# EAGLE design flatsat (EAGLE 7.4.0)
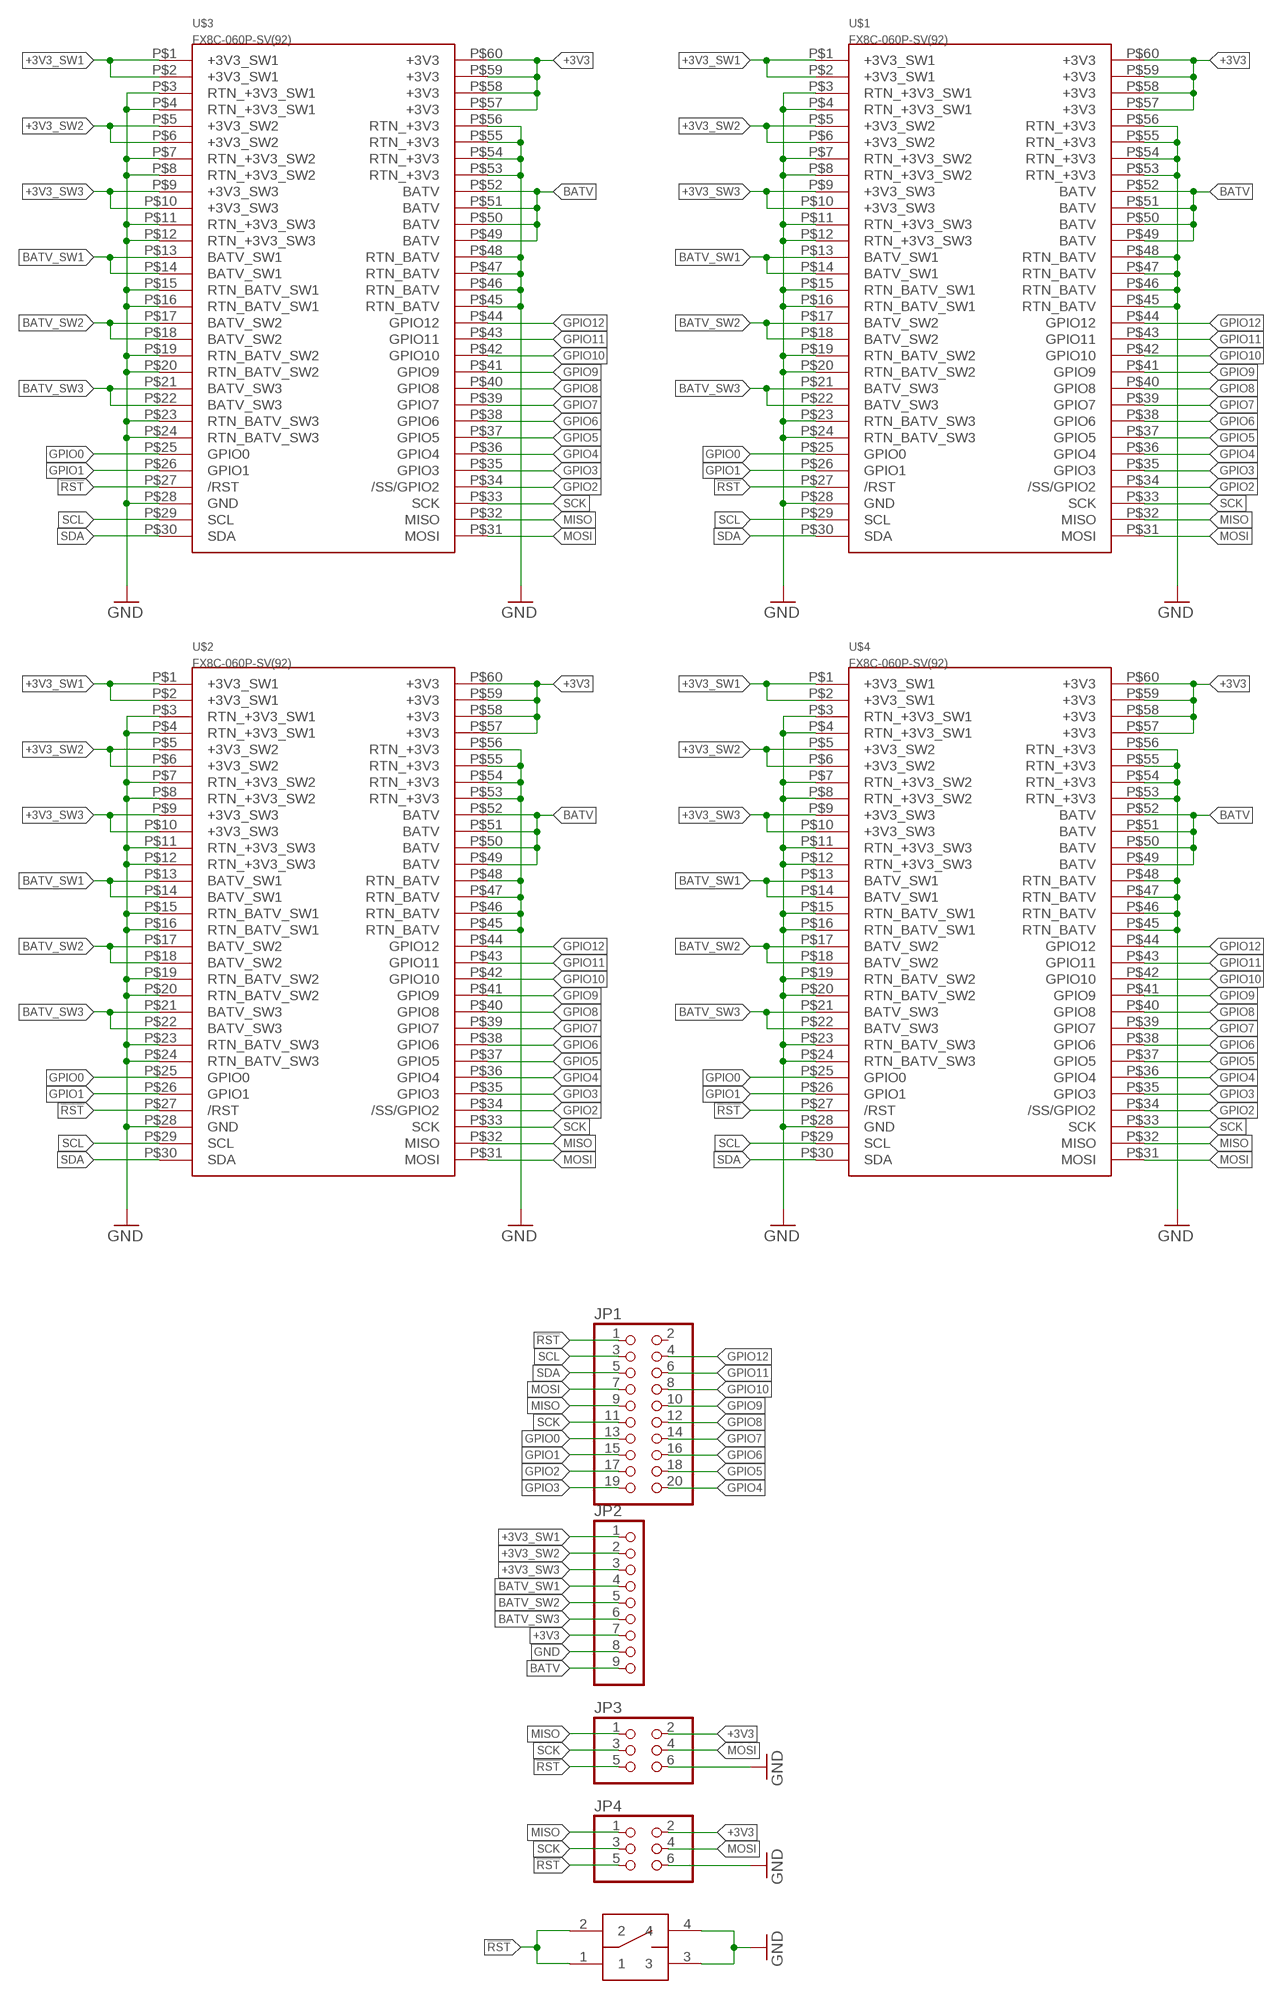
[diagram p0: schematic, sheet 1]

## Parts
JP1  PINHD-2X10  [2X10]
JP2  PINHD-1X9  [1X09]
JP3  PINHD-2X3  [2X03]
JP4  PINHD-2X3  [2X03]
U$1  FX8C-060P-SV(92)  [FX8C-060P-SV(92)]
U$2  FX8C-060P-SV(92)  [FX8C-060P-SV(92)]
U$3  FX8C-060P-SV(92)  [FX8C-060P-SV(92)]
U$4  FX8C-060P-SV(92)  [FX8C-060P-SV(92)]
U$5  SWITCH-TL3301  [SWITCH-TL3301]

## Nets
!RST: JP1.1 JP3.5 JP4.5 U$1.P$27(/RST) U$2.P$27(/RST) U$3.P$27(/RST) U$4.P$27(/RST) U$5.1 U$5.2
+3V3: JP2.7 JP3.2 JP4.2 U$1.P$57(+3V3) U$1.P$58(+3V3) U$1.P$59(+3V3) U$1.P$60(+3V3) U$2.P$57(+3V3) U$2.P$58(+3V3) U$2.P$59(+3V3) U$2.P$60(+3V3) U$3.P$57(+3V3) U$3.P$58(+3V3) U$3.P$59(+3V3) U$3.P$60(+3V3) U$4.P$57(+3V3) U$4.P$58(+3V3) U$4.P$59(+3V3) U$4.P$60(+3V3)
+3V3_SW1: JP2.1 U$1.P$1(+3V3_SW1) U$1.P$2(+3V3_SW1) U$2.P$1(+3V3_SW1) U$2.P$2(+3V3_SW1) U$3.P$1(+3V3_SW1) U$3.P$2(+3V3_SW1) U$4.P$1(+3V3_SW1) U$4.P$2(+3V3_SW1)
+3V3_SW2: JP2.2 U$1.P$5(+3V3_SW2) U$1.P$6(+3V3_SW2) U$2.P$5(+3V3_SW2) U$2.P$6(+3V3_SW2) U$3.P$5(+3V3_SW2) U$3.P$6(+3V3_SW2) U$4.P$5(+3V3_SW2) U$4.P$6(+3V3_SW2)
+3V3_SW3: JP2.3 U$1.P$9(+3V3_SW3) U$1.P$10(+3V3_SW3) U$2.P$9(+3V3_SW3) U$2.P$10(+3V3_SW3) U$3.P$9(+3V3_SW3) U$3.P$10(+3V3_SW3) U$4.P$9(+3V3_SW3) U$4.P$10(+3V3_SW3)
BATV: JP2.9 U$1.P$49(BATV) U$1.P$50(BATV) U$1.P$51(BATV) U$1.P$52(BATV) U$2.P$49(BATV) U$2.P$50(BATV) U$2.P$51(BATV) U$2.P$52(BATV) U$3.P$49(BATV) U$3.P$50(BATV) U$3.P$51(BATV) U$3.P$52(BATV) U$4.P$49(BATV) U$4.P$50(BATV) U$4.P$51(BATV) U$4.P$52(BATV)
BATV_SW1: JP2.4 U$1.P$13(BATV_SW1) U$1.P$14(BATV_SW1) U$2.P$13(BATV_SW1) U$2.P$14(BATV_SW1) U$3.P$13(BATV_SW1) U$3.P$14(BATV_SW1) U$4.P$13(BATV_SW1) U$4.P$14(BATV_SW1)
BATV_SW2: JP2.5 U$1.P$17(BATV_SW2) U$1.P$18(BATV_SW2) U$2.P$17(BATV_SW2) U$2.P$18(BATV_SW2) U$3.P$17(BATV_SW2) U$3.P$18(BATV_SW2) U$4.P$17(BATV_SW2) U$4.P$18(BATV_SW2)
BATV_SW3: JP2.6 U$1.P$21(BATV_SW3) U$1.P$22(BATV_SW3) U$2.P$21(BATV_SW3) U$2.P$22(BATV_SW3) U$3.P$21(BATV_SW3) U$3.P$22(BATV_SW3) U$4.P$21(BATV_SW3) U$4.P$22(BATV_SW3)
GND: JP2.8 JP3.6 JP4.6 U$1.P$3(RTN_+3V3_SW1) U$1.P$4(RTN_+3V3_SW1) U$1.P$7(RTN_+3V3_SW2) U$1.P$8(RTN_+3V3_SW2) U$1.P$11(RTN_+3V3_SW3) U$1.P$12(RTN_+3V3_SW3) U$1.P$15(RTN_BATV_SW1) U$1.P$16(RTN_BATV_SW1) U$1.P$19(RTN_BATV_SW2) U$1.P$20(RTN_BATV_SW2) U$1.P$23(RTN_BATV_SW3) U$1.P$24(RTN_BATV_SW3) U$1.P$28(GND) U$1.P$45(RTN_BATV) U$1.P$46(RTN_BATV) U$1.P$47(RTN_BATV) U$1.P$48(RTN_BATV) U$1.P$53(RTN_+3V3) U$1.P$54(RTN_+3V3) U$1.P$55(RTN_+3V3) U$1.P$56(RTN_+3V3) U$2.P$3(RTN_+3V3_SW1) U$2.P$4(RTN_+3V3_SW1) U$2.P$7(RTN_+3V3_SW2) U$2.P$8(RTN_+3V3_SW2) U$2.P$11(RTN_+3V3_SW3) U$2.P$12(RTN_+3V3_SW3) U$2.P$15(RTN_BATV_SW1) U$2.P$16(RTN_BATV_SW1) U$2.P$19(RTN_BATV_SW2) U$2.P$20(RTN_BATV_SW2) U$2.P$23(RTN_BATV_SW3) U$2.P$24(RTN_BATV_SW3) U$2.P$28(GND) U$2.P$45(RTN_BATV) U$2.P$46(RTN_BATV) U$2.P$47(RTN_BATV) U$2.P$48(RTN_BATV) U$2.P$53(RTN_+3V3) U$2.P$54(RTN_+3V3) U$2.P$55(RTN_+3V3) U$2.P$56(RTN_+3V3) U$3.P$3(RTN_+3V3_SW1) U$3.P$4(RTN_+3V3_SW1) U$3.P$7(RTN_+3V3_SW2) U$3.P$8(RTN_+3V3_SW2) U$3.P$11(RTN_+3V3_SW3) U$3.P$12(RTN_+3V3_SW3) U$3.P$15(RTN_BATV_SW1) U$3.P$16(RTN_BATV_SW1) U$3.P$19(RTN_BATV_SW2) U$3.P$20(RTN_BATV_SW2) U$3.P$23(RTN_BATV_SW3) U$3.P$24(RTN_BATV_SW3) U$3.P$28(GND) U$3.P$45(RTN_BATV) U$3.P$46(RTN_BATV) U$3.P$47(RTN_BATV) U$3.P$48(RTN_BATV) U$3.P$53(RTN_+3V3) U$3.P$54(RTN_+3V3) U$3.P$55(RTN_+3V3) U$3.P$56(RTN_+3V3) U$4.P$3(RTN_+3V3_SW1) U$4.P$4(RTN_+3V3_SW1) U$4.P$7(RTN_+3V3_SW2) U$4.P$8(RTN_+3V3_SW2) U$4.P$11(RTN_+3V3_SW3) U$4.P$12(RTN_+3V3_SW3) U$4.P$15(RTN_BATV_SW1) U$4.P$16(RTN_BATV_SW1) U$4.P$19(RTN_BATV_SW2) U$4.P$20(RTN_BATV_SW2) U$4.P$23(RTN_BATV_SW3) U$4.P$24(RTN_BATV_SW3) U$4.P$28(GND) U$4.P$45(RTN_BATV) U$4.P$46(RTN_BATV) U$4.P$47(RTN_BATV) U$4.P$48(RTN_BATV) U$4.P$53(RTN_+3V3) U$4.P$54(RTN_+3V3) U$4.P$55(RTN_+3V3) U$4.P$56(RTN_+3V3) U$5.3 U$5.4
GPIO0: JP1.13 U$1.P$25(GPIO0) U$2.P$25(GPIO0) U$3.P$25(GPIO0) U$4.P$25(GPIO0)
GPIO1: JP1.15 U$1.P$26(GPIO1) U$2.P$26(GPIO1) U$3.P$26(GPIO1) U$4.P$26(GPIO1)
GPIO2: JP1.17 U$1.P$34(/SS/GPIO2) U$2.P$34(/SS/GPIO2) U$3.P$34(/SS/GPIO2) U$4.P$34(/SS/GPIO2)
GPIO3: JP1.19 U$1.P$35(GPIO3) U$2.P$35(GPIO3) U$3.P$35(GPIO3) U$4.P$35(GPIO3)
GPIO4: JP1.20 U$1.P$36(GPIO4) U$2.P$36(GPIO4) U$3.P$36(GPIO4) U$4.P$36(GPIO4)
GPIO5: JP1.18 U$1.P$37(GPIO5) U$2.P$37(GPIO5) U$3.P$37(GPIO5) U$4.P$37(GPIO5)
GPIO6: JP1.16 U$1.P$38(GPIO6) U$2.P$38(GPIO6) U$3.P$38(GPIO6) U$4.P$38(GPIO6)
GPIO7: JP1.14 U$1.P$39(GPIO7) U$2.P$39(GPIO7) U$3.P$39(GPIO7) U$4.P$39(GPIO7)
GPIO8: JP1.12 U$1.P$40(GPIO8) U$2.P$40(GPIO8) U$3.P$40(GPIO8) U$4.P$40(GPIO8)
GPIO9: JP1.10 U$1.P$41(GPIO9) U$2.P$41(GPIO9) U$3.P$41(GPIO9) U$4.P$41(GPIO9)
GPIO10: JP1.8 U$1.P$42(GPIO10) U$2.P$42(GPIO10) U$3.P$42(GPIO10) U$4.P$42(GPIO10)
GPIO11: JP1.6 U$1.P$43(GPIO11) U$2.P$43(GPIO11) U$3.P$43(GPIO11) U$4.P$43(GPIO11)
GPIO12: JP1.4 U$1.P$44(GPIO12) U$2.P$44(GPIO12) U$3.P$44(GPIO12) U$4.P$44(GPIO12)
MISO: JP1.9 JP3.1 JP4.1 U$1.P$32(MISO) U$2.P$32(MISO) U$3.P$32(MISO) U$4.P$32(MISO)
MOSI: JP1.7 JP3.4 JP4.4 U$1.P$31(MOSI) U$2.P$31(MOSI) U$3.P$31(MOSI) U$4.P$31(MOSI)
SCK: JP1.11 JP3.3 JP4.3 U$1.P$33(SCK) U$2.P$33(SCK) U$3.P$33(SCK) U$4.P$33(SCK)
SCL: JP1.3 U$1.P$29(SCL) U$2.P$29(SCL) U$3.P$29(SCL) U$4.P$29(SCL)
SDA: JP1.5 U$1.P$30(SDA) U$2.P$30(SDA) U$3.P$30(SDA) U$4.P$30(SDA)
Unconnected: JP1.2

## Library data of the parts
JP1 = pinhead:PINHD-2X10: PIN HEADER
JP2 = pinhead:PINHD-1X9: PIN HEADER
JP3 JP4 = pinhead:PINHD-2X3: PIN HEADER
U$1-U$4 = PQ60:FX8C-060P-SV(92)
U$5 = switch-tl3301:SWITCH-TL3301

## Net classes
0 default: clearance 0.205 mm

## Board
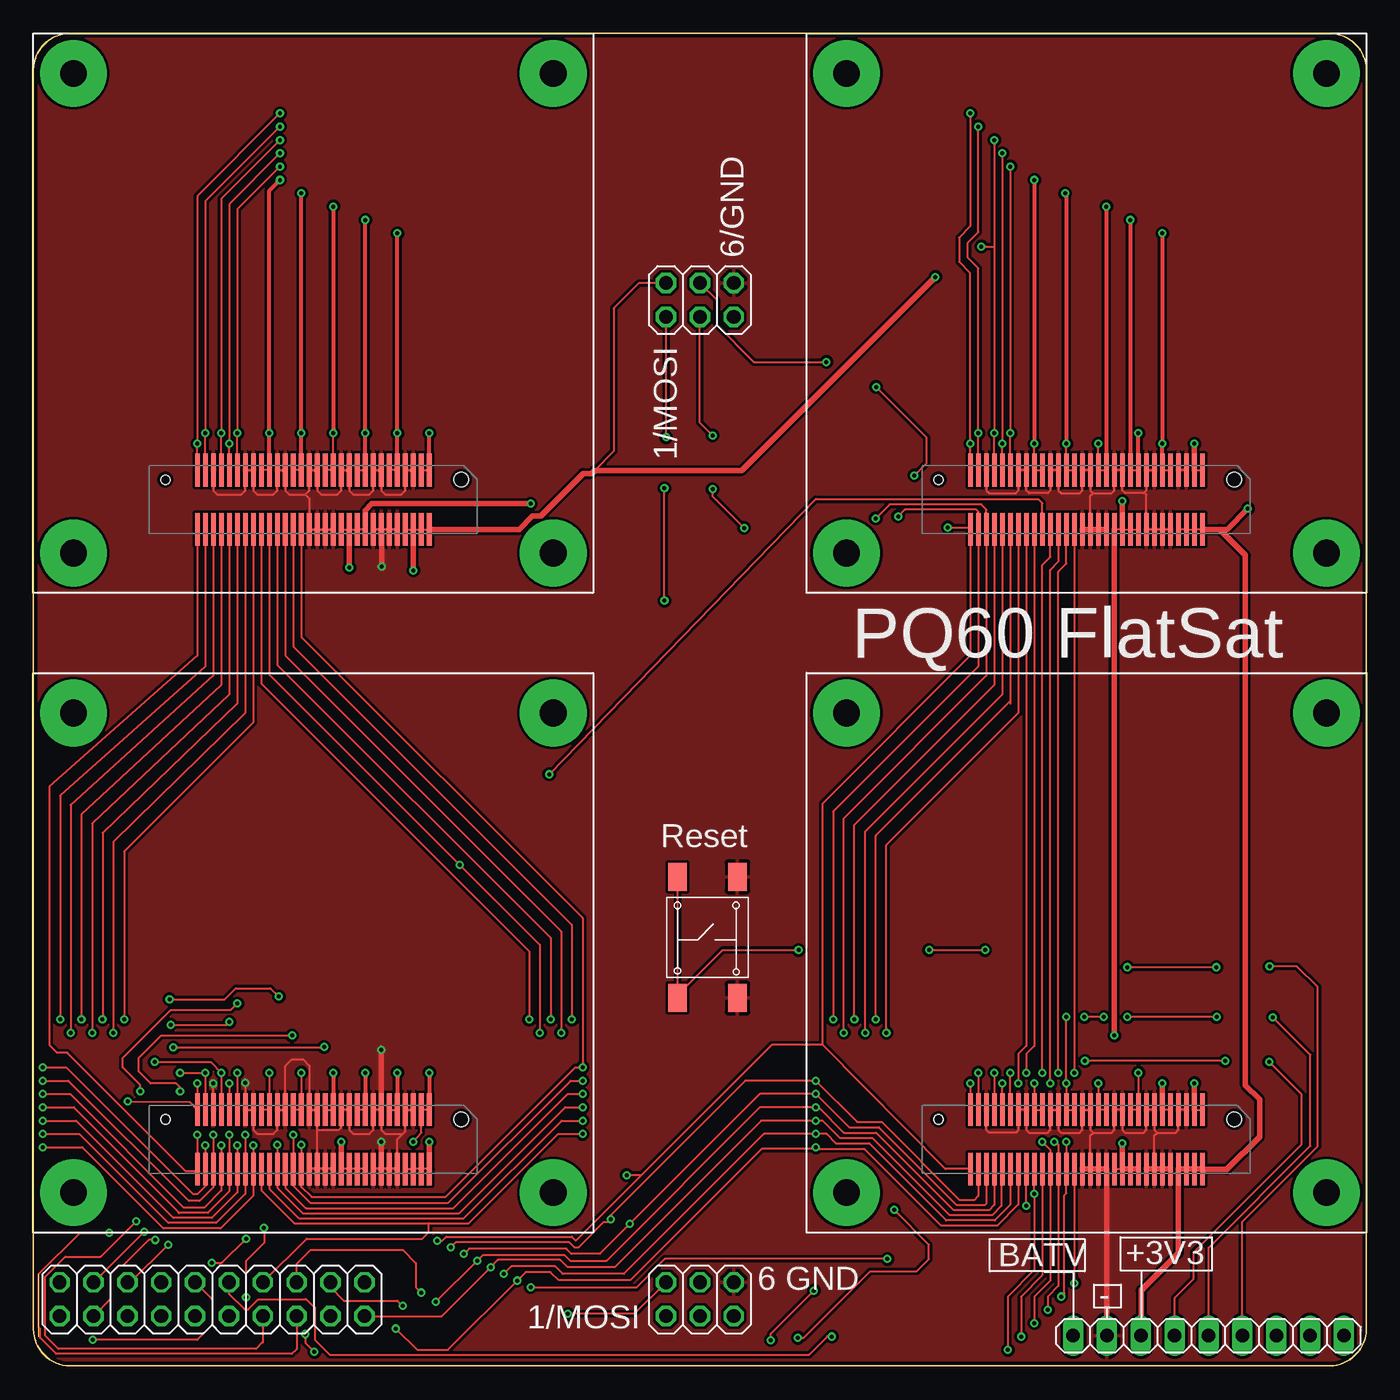
[diagram p1: board, top side]
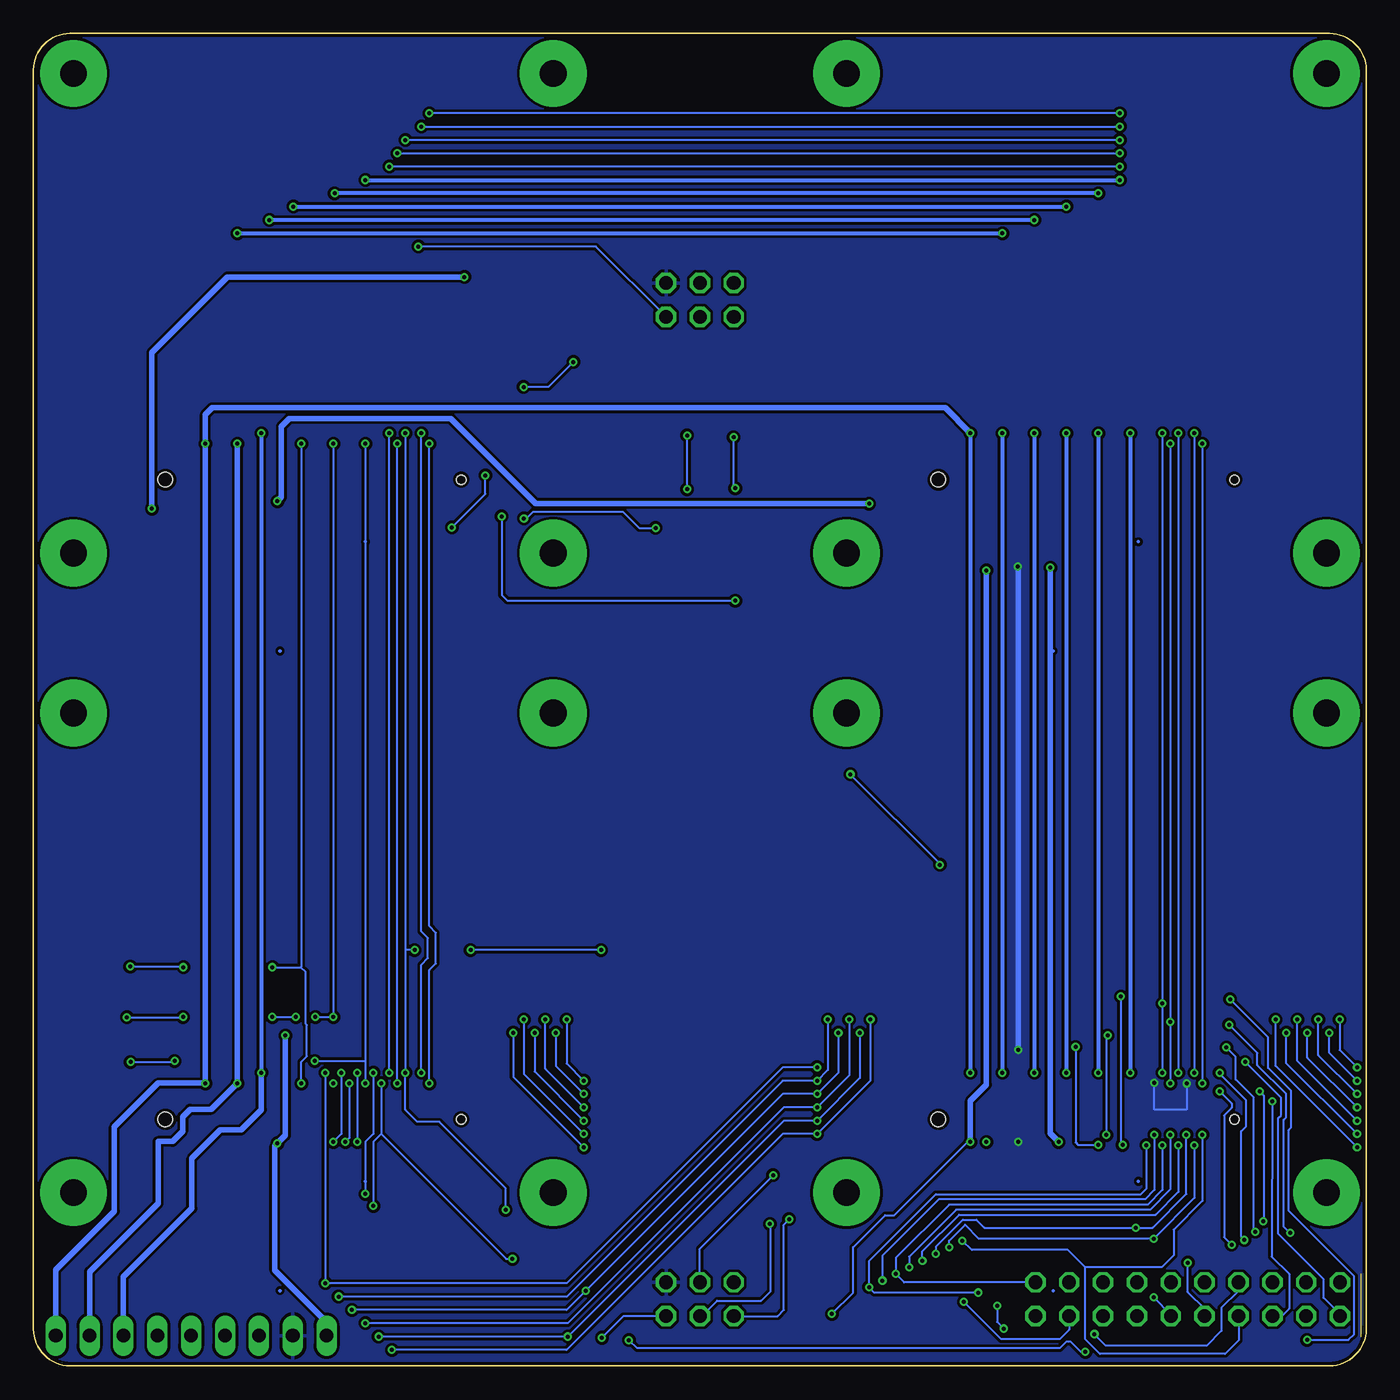
[diagram p2: board, bottom side, seen from below]

Size 100.01 x 100.01 mm. Coordinates in mm from the lower left corner, seen from the top.
Outline: 3.01,100.01 97.01,100.01 arc-98 100.01,97.01 100.01,3.01 arc-98 97.01,0.01 3.01,0.01 arc-98 0.01,3.01 0.01,97.01 arc-98 3.01,100.01
Copper layers (1*16): Top 0.035mm / dielectric 1.5mm / Bottom 0.035mm
Design rules "ITeadstudio *": minimum track width 6mil, minimum drill 0.3mm, track to track 6mil, track to pad 6mil, pad to pad 6mil, via to via 6mil, smd to smd 0mil, copper to edge 10mil, drill to drill 10mil, minimum pad ring 10mil, minimum via ring 6mil, stop-mask expansion 2mil, vias tented up to drill 100mil, thermal gap 10mil

### Footprints (pad centres in the part's own frame; a part is rotated, then mirrored left to right if it is on the bottom)
2X10 = drill 1.016 octagon: 1 -11.43,-1.27; 2 -11.43,1.27; 3 -8.89,-1.27; 4 -8.89,1.27; 5 -6.35,-1.27; 6 -6.35,1.27; 7 -3.81,-1.27; 8 -3.81,1.27; 9 -1.27,-1.27; 10 -1.27,1.27; 11 1.27,-1.27; 12 1.27,1.27; 13 3.81,-1.27; 14 3.81,1.27; 15 6.35,-1.27; 16 6.35,1.27; 17 8.89,-1.27; 18 8.89,1.27; 19 11.43,-1.27; 20 11.43,1.27
1X09 = drill 1.016 long: 1 -10.16,0; 2 -7.62,0; 3 -5.08,0; 4 -2.54,0; 5 0,0; 6 2.54,0; 7 5.08,0; 8 7.62,0; 9 10.16,0
2X03 = drill 1.016 octagon: 1 -2.54,-1.27; 2 -2.54,1.27; 3 0,-1.27; 4 0,1.27; 5 2.54,-1.27; 6 2.54,1.27
FX8C-060P-SV(92) = smd 0.35 x 2.45: P$1 -8.7,-2.225; P$2 -8.1,-2.225; P$3 -7.5,-2.225; P$4 -6.9,-2.225; P$5 -6.3,-2.225; P$6 -5.7,-2.225; P$7 -5.1,-2.225; P$8 -4.5,-2.225; P$9 -3.9,-2.225; P$10 -3.3,-2.225; P$11 -2.7,-2.225; P$12 -2.1,-2.225; P$13 -1.5,-2.225; P$14 -0.9,-2.225; P$15 -0.3,-2.225; P$16 0.3,-2.225; P$17 0.9,-2.225; P$18 1.5,-2.225; P$19 2.1,-2.225; P$20 2.7,-2.225; P$21 3.3,-2.225; P$22 3.9,-2.225; P$23 4.5,-2.225; P$24 5.1,-2.225; P$25 5.7,-2.225; P$26 6.3,-2.225; P$27 6.9,-2.225; P$28 7.5,-2.225; P$29 8.1,-2.225; P$30 8.7,-2.225; P$31 8.7,2.225; P$32 8.1,2.225; P$33 7.5,2.225; P$34 6.9,2.225; P$35 6.3,2.225; P$36 5.7,2.225; P$37 5.1,2.225; P$38 4.5,2.225; P$39 3.9,2.225; P$40 3.3,2.225; P$41 2.7,2.225; P$42 2.1,2.225; P$43 1.5,2.225; P$44 0.9,2.225; P$45 0.3,2.225; P$46 -0.3,2.225; P$47 -0.9,2.225; P$48 -1.5,2.225; P$49 -2.1,2.225; P$50 -2.7,2.225; P$51 -3.3,2.225; P$52 -3.9,2.225; P$53 -4.5,2.225; P$54 -5.1,2.225; P$55 -5.7,2.225; P$56 -6.3,2.225; P$57 -6.9,2.225; P$58 -7.5,2.225; P$59 -8.1,2.225; P$60 -8.7,2.225 | hole 1.1: -11.1,-1.5 | hole 0.7: 11.1,-1.5
SWITCH-TL3301 = smd 1.4 x 2.1: 1 -2.3,-4.55; 2 -2.3,4.55; 3 2.2,-4.55; 4 2.2,4.55

### Placement (x,y rotation side)
JP1  13.41,5.01 0 top
JP2  88.17,2.27 180 top
JP3  50.01,5.01 0 top
JP4  50.01,80.01 0 top
U$1  21.01,65.01 180 top
U$2  79.01,65.01 180 top
U$3  79.01,17.01 180 top
U$4  21.01,17.01 180 top
U$5  50.63,32.16 0 top

### Tracks (layer width: path | path; a pad name or v marks a point on that pad's centre or on a via)
!RST  (via drill 0.3)
  Top 0.152: U$1.P$27 v14.11,70.01 14.11,87.61 v18.51,92.01 | U$4.P$27 v14.11,22.01 13.31,22.81 v9.11,22.81 | v72.11,92.01 72.11,84 | 72.11,84 v72.11,70.01 U$2.P$27 | v72.11,22.01 U$3.P$27 | U$5.2 U$5.1 48.33,27.83 51.71,31.21 v57.41,31.21 | v67.21,31.21 v71.41,31.21 | v71.13,84.01 71.51,84 72.11,84 | v57.36,2.11 57.79,2.11 62.77,7.09 66.28,7.09 67.19,8.01 67.19,9.1 v64.57,11.72
  Bottom 0.152: v14.11,70.01 v14.11,22.01 | v18.51,92.01 v72.11,92.01 | v72.11,70.01 72.11,31.21 | 72.11,31.21 v72.11,22.01 U$3.P$27 71.19,18.32 69.55,18.32 64.57,13.34 v64.57,11.72 | JP1.1 1.98,3.88 3.21,5.11 3.21,6.51 6.61,9.91 6.61,18.61 6.41,18.81 6.41,20.11 v9.11,22.81 | v57.41,31.21 v67.21,31.21 | v71.41,31.21 72.11,31.21 | JP4.5 57.82,84.01 v71.13,84.01 | JP3.5 55.74,3.74 v57.36,2.11
+3V3  (via drill 0.3)
  Top 0.152: U$1.P$57 U$1.P$58 U$1.P$59 U$1.P$60 | U$4.P$60 U$4.P$59 U$4.P$58 U$4.P$57 | U$2.P$60 U$2.P$59 U$2.P$58 U$2.P$57 | JP3.2 45.1,3.91 v40.11,3.91 | JP4.2 45.44,81.28 43.54,79.38 43.54,68.64 42.11,67.21
  Top 0.4: U$4.P$60 v29.71,16.81 | v28.51,59.71 U$1.P$58 | U$1.P$60 36.44,62.78 37.45,63.79 38.06,63.79 41.26,66.99 41.89,66.99 42.11,67.21 53.16,67.21 v67.67,81.72 67.66,81.71 | JP2.7 83.12,2.29 83.12,5.67 85.91,8.46 U$3.P$57 U$3.P$58 U$3.P$59 U$3.P$60 87.75,14.74 89.54,14.74 92.01,17.2 92.01,20.01 90.94,21.07 90.94,60.84 89,62.78 U$2.P$60 89.55,62.78 v91.12,64.34
  Bottom 0.152: v40.11,3.91 38.51,5.51 38.51,8.91 36.11,11.31 35.41,11.31 29.91,16.81 v29.71,16.81
  Bottom 0.4: v29.71,16.81 29.71,19.91 28.51,21.11 v28.51,59.71 | v67.67,81.72 85.45,81.72 91.12,76.05 v91.12,64.34
+3V3_SW1  (via drill 0.3)
  Top 0.152: U$1.P$2 U$1.P$1 | U$4.P$1 U$4.P$2 29.11,17.51 v28.51,16.81 | U$2.P$2 U$2.P$1 | U$3.P$2 U$3.P$1
  Top 0.305: U$1.P$1 v29.71,70.01 | v29.71,22.01 U$4.P$1
  Top 0.4: v87.11,21.21 U$3.P$2 | U$2.P$2 v87.11,69.21
  Bottom 0.305: v29.71,70.01 v29.71,22.01
  Bottom 0.4: v29.71,70.01 31.61,71.91 86.61,71.91 87.11,71.41 v87.11,69.21 v87.11,21.21 87.14,21.24 90.63,21.24 93.94,17.94 93.94,11.61 98.33,7.22 JP2.1
+3V3_SW2  (via drill 0.3)
  Top 0.152: U$1.P$5 U$1.P$6 | U$4.P$6 U$4.P$5 | U$2.P$5 U$2.P$6 84.71,66.51 | U$3.P$5 U$3.P$6
  Top 0.305: U$1.P$5 v27.31,70.01 v27.31,85.01 | v27.31,22.01 U$4.P$5 | v84.71,85.01 v84.71,69.21 U$2.P$6
  Top 0.4: v84.71,21.21 U$3.P$6
  Bottom 0.305: v27.31,70.01 v27.31,22.01 | v84.71,85.01 v27.31,85.01
  Bottom 0.4: v84.71,69.21 v84.71,21.21 86.65,19.26 88.25,19.26 88.81,18.7 88.81,17.61 89.57,16.85 90.66,16.85 90.66,12.2 95.79,7.07 JP2.2
+3V3_SW3  (via drill 0.3)
  Top 0.152: U$1.P$10 U$1.P$9 | U$4.P$9 U$4.P$10 | U$2.P$10 U$2.P$9 | U$3.P$10 U$3.P$9 v82.91,22.01
  Top 0.305: U$1.P$9 v24.91,70.01 v24.91,86.01 | v24.91,22.01 U$4.P$9 | v82.31,86.01 U$2.P$10 | U$2.P$9 v82.91,70.01
  Bottom 0.305: v24.91,70.01 v24.91,22.01 | v24.91,86.01 v82.31,86.01 | v82.91,70.01 v82.91,22.01
  Bottom 0.4: JP2.3 93.25,6.69 88.12,11.82 88.12,15.58 85.99,17.71 84.43,17.71 U$3.P$9 v82.91,22.01
BATV  (via drill 0.3)
  Top 0.152: U$1.P$49 U$1.P$50 U$1.P$51 U$1.P$52 | U$4.P$49 U$4.P$50 U$4.P$52 U$4.P$51 | U$2.P$52 U$2.P$51 U$2.P$50 U$2.P$49 | U$3.P$49 U$3.P$50
  Top 0.4: v23.1,16.81 23.1,14.79 U$4.P$49 | v23.71,59.91 U$1.P$50 | U$3.P$52 U$3.P$51 U$3.P$50 v81.71,16.71 | U$1.P$52 24.91,64.21 25.41,64.71 v37.31,64.71 | v81.71,64.91 U$2.P$50 | v81.11,24.8 U$2.P$49
  Bottom 0.4: v23.1,16.81 23.71,17.46 v23.71,59.91 | v81.11,24.8 81.11,17.3 v81.71,16.71 81.9,16.52 81.9,7.17 78.01,3.28 JP2.9 | v37.31,64.71 62.31,64.71 68.71,71.11 80.81,71.11 81.41,70.51 81.41,65.21 v81.71,64.91
BATV_SW1  (via drill 0.3)
  Top 0.152: U$1.P$14 U$1.P$13 v22.51,70.01 | U$4.P$14 U$4.P$13 | U$2.P$13 U$2.P$14 v79.91,69.21 | U$3.P$13 U$3.P$14 v79.91,21.21 | JP2.4 90.71,10.83 96.35,16.47 96.35,28.43 94.8,29.98 v92.74,29.98 | v88.75,29.93 v82.07,29.93
  Top 0.305: v22.51,22.01 U$4.P$13 | v80.51,87.01 U$2.P$13 | v22.51,87.01 v22.51,70.01
  Bottom 0.152: v79.91,69.21 79.91,29.98 79.96,29.93 | v92.74,29.98 88.8,29.98 v88.75,29.93 | v82.07,29.93 79.96,29.93 | v79.91,21.21 79.91,22.82 79.48,23.25 79.48,25.58 79.58,25.69 79.58,29.56 79.96,29.93
  Bottom 0.305: v22.51,70.01 v22.51,22.01 | v80.51,87.01 v22.51,87.01
BATV_SW2  (via drill 0.3)
  Top 0.152: U$1.P$17 U$1.P$18 | v20.11,22.01 U$4.P$17 U$4.P$18 | U$2.P$17 U$2.P$18 v77.51,69.21 | U$3.P$17 U$3.P$18 v77.51,21.21 v77.51,26.19 | JP2.5 88.17,8.87 95.82,16.52 95.82,23.35 v93,26.17 | v88.78,26.19 v82.07,26.19 | v80.32,26.19 v78.85,26.19
  Top 0.305: U$1.P$17 v20.11,70.01 v20.11,88.01 | v77.41,88.01 77.51,88.01 v77.51,69.21
  Bottom 0.152: v77.51,69.21 v77.51,26.19 v78.85,26.19 | v93,26.17 88.8,26.17 v88.78,26.19 | v82.07,26.19 v80.32,26.19
  Bottom 0.305: v20.11,70.01 v20.11,22.01 | v20.11,88.01 v77.41,88.01
BATV_SW3  (via drill 0.3)
  Top 0.152: U$1.P$21 U$1.P$22 | v17.71,22.01 U$4.P$21 U$4.P$22 | U$2.P$21 U$2.P$22 v75.11,69.21 | v75.11,21.21 U$3.P$22 U$3.P$21 | JP2.6 85.63,5.11 87.05,6.53 87.05,8.52 95.15,16.62 95.15,20.38 v92.72,22.82 | v89.41,22.89 v78.9,22.89
  Top 0.305: U$1.P$21 v17.71,70.01 17.71,88.21 v18.51,89.01 | v75.11,89.01 v75.11,69.21
  Bottom 0.152: v75.11,69.21 75.11,22.92 | 75.11,22.92 v75.11,21.21 | v92.72,22.82 89.49,22.82 v89.41,22.89 | v78.9,22.89 75.13,22.89 75.11,22.92
  Bottom 0.305: v17.71,70.01 v17.71,22.01 | v75.11,89.01 v18.51,89.01
CHASSIS_GND  (via drill 2 pad 5)
  other vias: 39.01,49.01
GND  (via drill 0.3)
  Top 0.152: U$1.P$28 13.51,65.71 13.81,65.41 15.61,65.41 15.91,65.71 U$1.P$24 U$1.P$23 16.51,65.71 16.81,65.41 18.01,65.41 18.31,65.71 U$1.P$20 U$1.P$19 18.91,65.71 19.21,65.41 20.41,65.41 | U$1.P$3 U$1.P$4 27.91,65.71 27.61,65.41 26.41,65.41 26.11,65.71 U$1.P$7 U$1.P$8 25.51,65.71 25.21,65.41 24.01,65.41 23.71,65.71 U$1.P$11 U$1.P$12 23.11,65.71 22.81,65.41 21.61,65.41 21.31,65.71 U$1.P$15 U$1.P$16 20.71,65.71 20.41,65.41 | U$1.P$48 U$1.P$47 U$1.P$46 U$1.P$45 20.71,65.11 20.41,65.41 | U$1.P$53 U$1.P$54 U$1.P$55 U$1.P$56 26.73,62.78 26.71,62.81 | U$4.P$3 U$4.P$4 27.91,17.61 27.71,17.41 | U$4.P$53 U$4.P$54 U$4.P$55 U$4.P$56 27.31,17.01 27.71,17.41 | U$4.P$48 U$4.P$47 U$4.P$46 | U$4.P$46 U$4.P$45 | 27.71,17.41 26.41,17.41 26.11,17.71 U$4.P$7 U$4.P$8 25.51,17.71 25.21,17.41 24.01,17.41 23.71,17.71 U$4.P$11 U$4.P$12 23.07,19.19 23.07,17.86 22.89,17.68 21.33,17.68 21.31,17.66 | U$2.P$28 71.51,65.71 71.71,65.51 73.71,65.51 73.91,65.71 U$2.P$24 U$2.P$23 74.51,65.71 74.71,65.51 76.11,65.51 76.31,65.71 U$2.P$20 U$2.P$19 76.91,65.71 77.11,65.51 78.51,65.51 78.71,65.71 U$2.P$16 U$2.P$15 79.31,65.71 79.51,65.51 | U$2.P$3 U$2.P$4 | 79.51,65.51 80.91,65.51 81.11,65.71 U$2.P$12 U$2.P$11 81.71,65.71 81.91,65.51 83.31,65.51 83.36,65.56 | U$2.P$7 U$2.P$8 83.51,65.71 83.36,65.56 | U$2.P$46 79.31,65.31 79.51,65.51 | U$2.P$56 U$2.P$55 U$2.P$54 U$2.P$53 83.51,65.41 83.36,65.56 | U$3.P$3 U$3.P$4 85.91,17.71 85.71,17.51 84.31,17.51 | U$3.P$28 71.51,17.71 71.71,17.51 73.71,17.51 73.91,17.71 U$3.P$24 U$3.P$23 74.51,17.71 74.71,17.51 76.11,17.51 76.31,17.71 U$3.P$20 U$3.P$19 76.91,17.71 77.11,17.51 78.51,17.51 78.71,17.71 U$3.P$16 U$3.P$15 79.31,17.71 79.51,17.51
  Top 0.152: 79.51,17.51 80.91,17.51 81.11,17.71 U$3.P$12 U$3.P$11 81.71,17.71 81.91,17.51 83.31,17.51 83.51,17.71 U$3.P$8 U$3.P$7 84.11,17.71 84.31,17.51 | U$3.P$54 84.11,17.31 84.31,17.51 | U$3.P$46 79.31,17.31 79.51,17.51 | U$4.P$28 13.49,19.24 v13.49,21.19 | v15.91,21.24 | v15.91,21.24 U$4.P$24 U$4.P$23 16.51,17.71 16.81,17.41 18.01,17.41 18.31,17.71 U$4.P$20 U$4.P$19 18.91,22.51 19.39,22.99 20.25,22.99 20.71,22.54 U$4.P$16 U$4.P$15 21.31,17.66 | U$4.P$46 21.31,17.66
  Top 0.4: v26.11,23.71 U$4.P$7 | v26.11,16.81 U$4.P$54 | U$3.P$56 U$3.P$55 U$3.P$54 U$3.P$53 | U$3.P$45 U$3.P$46 U$3.P$47 U$3.P$48 80.55,14.74 JP2.8 | U$2.P$48 U$2.P$47 U$2.P$46 U$2.P$45 | v26.14,60 26.14,62.74 U$1.P$54
  Bottom 0.152: v13.49,21.19 13.49,19.23 U$4.P$28 U$4.P$24 | U$4.P$24 | U$4.P$24 v15.91,21.24
  Bottom 0.4: v26.11,23.71 26.11,59.96 v26.14,60
  pour Top: 48.19,100.06 0.03,100.06 0.03,0.01 100.01,0.01 100.01,100.01 48.47,100.01 48.47,100.13
  pour Bottom: 46.64,100.03 -0.04,100.03 -0.04,-0.02 100.01,-0.02 100.01,100.06 99.37,100.06
GPIO0  (via drill 0.3)
  Top 0.152: U$1.P$25 v15.31,70.01 15.31,86.81 v18.51,90.01 | v15.31,22.01 U$4.P$25 | v73.31,90.01 v73.31,70.01 U$2.P$25 | U$3.P$25 v73.31,22.01 | JP1.13 17.22,1.76 17.19,1.76 16.71,1.28 1.88,1.28 0.91,2.25 0.91,6.71 2.41,8.21 5.04,8.21 v7.73,10.85 | v8.01,20.61 8.01,21.11 6.71,22.41 6.71,23.11 10.31,26.71 14.81,26.71 v15.31,27.21
  Bottom 0.152: v15.31,70.01 v15.31,27.21 v15.31,22.01 | v18.51,90.01 v73.31,90.01 | v73.31,22.01 v73.31,70.01 | v8.01,20.61 7.71,20.31 7.71,10.87 v7.73,10.85
GPIO1  (via drill 0.3)  (1 unrouted)
  Top 0.152: U$1.P$26 v14.71,69.21 14.71,87.21 v18.51,91.01 | v14.71,21.21 U$4.P$26 | v72.71,91.01 v72.71,69.21 U$2.P$26 | U$3.P$26 v72.71,21.21 | JP1.15 19.76,1.26 19.41,0.91 1.71,0.91 0.51,2.11 0.51,2.81 0.41,2.91 0.41,6.91 3.51,10.01 4.31,10.01 v5.7,10.01 | v10.31,25.61 14.51,25.61 v14.71,25.81
  Bottom 0.152: v14.71,69.21 v14.71,25.81 v14.71,21.21 | v72.71,91.01 v18.51,91.01 | v72.71,21.21 v72.71,69.21 | v10.31,25.61 8.19,23.49 8.19,22.56 6.03,20.4 6.03,18.65 6.2,18.47 6.2,10.45 5.76,10.01 v5.7,10.01
GPIO2  (via drill 0.3)
  Top 0.152: U$1.P$34 14.11,51.11 3.61,41.41 v3.61,26.01 | U$4.P$34 14.1,13.16 12.81,11.87 11.29,11.87 2.76,20.41 v0.71,20.41 | U$2.P$34 72.11,51.11 61.61,40.61 v61.61,26.01 | 14.11,15.85 U$4.P$34 | v14.11,16.57 U$4.P$34 | v30.21,4.81 v33.31,7.91 33.74,8.34 39.83,8.34 40.27,7.91 43.01,7.91 54.51,19.41 v58.71,19.41 58.91,19.41 60.81,17.51 63.23,17.51 69.06,11.68 71.71,11.68 72.11,12.08 U$3.P$34
  Bottom 0.152: v0.71,20.41 3.61,23.31 v3.61,26.01 | v58.71,19.41 61.61,22.31 v61.61,26.01 | v33.31,7.91 33.31,8.61 30.56,11.35 15.81,11.35 14.11,13.05 v14.11,16.57 | JP1.17 22.3,2.72 23.01,2.01 27.41,2.01 v30.21,4.81
GPIO3  (via drill 0.3)
  Top 0.152: U$1.P$35 14.71,50.41 4.41,40.71 4.41,25.01 v4.43,25.01 | 10.95,11.49 13.09,11.49 14.71,13.11 14.71,14.77 U$4.P$35 14.71,15.32 | 10.95,11.49 10.87,11.49 | U$2.P$35 72.71,50.41 62.41,40.11 v62.41,25.01 | U$3.P$35 72.63,14.78 72.63,12 71.93,11.3 68.76,11.3 62.95,17.11 60.51,17.11 59.21,18.41 v58.71,18.41 54.61,18.41 43.61,7.41 40.08,7.41 39.53,7.96 34.86,7.96 v34.31,7.41 30.64,3.74 JP1.19 | 14.71,15.32 | v14.71,17.35 14.71,15.32 | v0.71,19.41 3.03,19.41 10.95,11.49
  Bottom 0.152: v0.71,19.41 4.43,23.13 v4.43,25.01 | v62.41,25.01 62.41,22.11 v58.71,18.41 | v14.71,17.35 14.71,13.26 16.23,11.73 30.78,11.73 34.31,8.21 v34.31,7.41
GPIO4  (via drill 0.3)
  Top 0.152: U$1.P$36 15.31,49.71 5.21,40.01 5.21,26.01 v5.19,26.01 | U$2.P$36 73.31,49.91 | 73.31,49.91 73.31,49.71 | v63.21,26.01 63.21,39.81 73.31,49.91 | v15.31,16.57 U$4.P$36 15.31,13.02 13.39,11.11 10.5,11.11 3.2,18.41 v0.71,18.41 | v35.31,6.91 35.87,7.47 39.15,7.47 39.72,6.91 44.31,6.91 54.81,17.41 v58.71,17.41 59.51,17.41 60.21,16.71 62.7,16.71 68.48,10.93 72.13,10.93 73.31,12.1 U$3.P$36
  Bottom 0.152: v0.71,18.41 5.19,22.89 v5.19,26.01 | v63.21,26.01 63.21,21.91 v58.71,17.41 | v15.31,16.57 15.31,13.21 16.41,12.11 31.31,12.11 35.31,8.11 v35.31,6.91 34.68,6.28 JP1.20
GPIO5  (via drill 0.3)
  Top 0.152: U$1.P$37 15.91,49.01 6.01,39.31 v6.01,25.01 v6,25.01 | U$4.P$37 | U$2.P$37 73.91,49.01 64.01,39.11 v64.01,25.01 | v58.71,16.41 58.71,16.31 | v15.91,17.35 U$4.P$37 | 58.71,16.31 54.66,16.31 44.79,6.43 39.4,6.43 38.79,7.04 36.94,7.04 v36.31,6.41 31.11,1.21 28.81,1.21 v27.21,2.81 | JP1.18 22.3,5.92 23.31,4.91 27.31,4.91 v27.71,4.51 | U$3.P$37 73.91,12.13 72.31,10.53 68.1,10.53 62.32,16.31 58.71,16.31 | U$4.P$37 15.91,12.91 13.72,10.73 10.13,10.73 3.45,17.41 v0.71,17.41
  Bottom 0.152: v0.71,17.41 6,22.7 v6,25.01 | v64.01,25.01 64.01,21.71 v58.71,16.41 | v15.91,17.35 15.91,13.21 16.6,12.51 32.08,12.51 36.31,8.28 v36.31,6.41 | v27.71,4.51 27.71,3.31 v27.21,2.81
GPIO6  (via drill 0.3)
  Top 0.152: U$1.P$38 16.51,48.31 6.81,38.61 v6.81,26.01 | U$2.P$38 74.51,24.01 73.91,23.41 v73.91,21.21 | v74.51,12.01 U$3.P$38 | v64.07,8.03 47.38,8.03 45.22,5.87 37.34,5.87 v37.31,5.91 | v16.51,16.57 U$4.P$38 16.52,14.77 16.52,12.78 14.05,10.32 9.76,10.32 3.68,16.41 v0.71,16.41 | JP1.16 19.76,7.66 20.81,8.71 27.71,8.71 28.71,7.71 28.71,5.91 v29.11,5.51
  Bottom 0.152: v0.71,16.41 6.81,22.51 v6.81,26.01 | v73.91,21.21 73.91,17.41 | 73.91,17.41 74.51,16.81 v74.51,12.01 | 73.91,17.41 64.53,8.03 v64.07,8.03 | v16.51,16.57 16.51,13.31 16.93,12.88 32.31,12.88 37.31,7.88 v37.31,5.91 36.91,5.51 v29.11,5.51
GPIO7  (via drill 0.3)
  Top 0.152: U$1.P$39 17.11,51.21 37.21,31.11 v37.21,26.01 | 29.67,10.71 19.58,10.71 17.11,13.18 U$4.P$39 | 29.67,10.71 32.68,10.71 39.38,17.41 v41.21,17.41 | v73.11,1.21 73.11,5.21 75.11,7.21 v75.11,12.91 U$3.P$39 | U$2.P$39 75.11,24.01 74.51,23.41 v74.51,22.01 | JP1.14 20.5,9.56 29.19,9.56 29.67,10.04 29.67,10.71
  Bottom 0.152: v37.21,26.01 37.21,21.41 v41.21,17.41 43.81,17.41 60.01,1.21 v73.11,1.21 | v74.51,22.01 74.51,17.41 75.11,16.81 v75.11,12.91
GPIO8  (via drill 0.3)
  Top 0.152: U$1.P$40 17.71,51.91 v32.01,37.61 38.01,31.61 v38.01,25.01 | U$3.P$40 75.71,6.81 74.11,5.21 v74.11,2.21 | v38.71,44.41 58.71,65.07 58.74,65.03 75.42,65.03 75.71,64.74 U$2.P$40 | U$4.P$40 17.71,13.28 19.91,11.08 32.31,11.08 39.63,18.41 v41.21,18.41 | v59.91,2.21 59.56,2.21 58.2,0.84 22.23,0.84 21.11,1.96 21.11,4.38 20.45,5.04 20.4,4.98 16.87,4.98 16.14,4.25 15.86,4.25 14.68,5.43 JP1.12
  Bottom 0.152: v38.01,25.01 38.01,21.61 v41.21,18.41 43.71,18.41 v59.91,2.21 v74.11,2.21 | v38.71,44.41 31.98,37.68 31.98,37.63 v32.01,37.61
GPIO9  (via drill 0.3)
  Top 0.152: U$1.P$41 18.31,52.61 38.81,32.11 v38.81,26.01 | v75.11,3.21 75.11,5.21 76.31,6.41 U$3.P$41 76.31,16.21 v75.71,16.81 | v41.21,19.41 39.9,19.41 31.96,11.46 20.2,11.46 18.31,13.36 U$4.P$41 18.29,14.79 v18.29,16.59 | JP1.10 13.42,5 13.42,3.08 12.3,1.96 v4.45,1.96 | v10.22,27.51 14.36,27.51 15.2,28.35 17.79,28.35 v18.42,27.72 | v75.71,22.01 75.71,60.11 76.31,60.71 U$2.P$41
  Bottom 0.152: v38.81,26.01 38.81,21.81 v41.21,19.41 43.71,19.41 59.91,3.21 v75.11,3.21 | v75.71,22.01 v75.71,16.81 | v4.45,1.96 1.35,1.96 0.92,2.39 0.92,6.74 5.82,11.64 5.82,17.71 5.65,17.89 5.65,20.63 7.37,22.36 7.37,24.67 v10.22,27.51 | v18.42,27.72 18.42,16.72 v18.29,16.59
GPIO10  (via drill 0.3)
  Top 0.152: U$1.P$42 18.91,53.31 39.61,32.61 v39.61,25.01 | v76.11,4.21 76.11,5.21 76.91,6.01 U$3.P$42 76.91,16.61 76.71,16.81 v76.61,16.81 | U$4.P$42 18.91,13.38 20.45,11.84 31.51,11.84 40.08,20.41 v41.21,20.41 | v55.33,1.94 55.33,2.42 v58.56,5.65 | v20.4,2.39 20.4,1.73 v21.09,1.05 | U$2.P$42 76.91,60.37 76.28,59.75 76.31,59.72 v76.31,21.21
  Bottom 0.152: v39.61,25.01 39.61,22.01 v41.21,20.41 43.81,20.41 v58.56,5.65 60.01,4.21 v76.11,4.21 | v76.31,21.21 76.31,17.11 v76.61,16.81 | JP1.8 9.6,5.66 10.88,4.38 10.88,2.62 11.97,1.53 19.54,1.53 v20.4,2.39 | v55.33,1.94 54.72,1.33 23.02,1.33 22.54,1.81 22.18,1.81 21.42,1.05 v21.09,1.05
GPIO11  (via drill 0.3)
  Top 0.152: U$1.P$43 19.51,54.01 40.41,33.11 v40.41,26.01 | v77.51,16.81 U$3.P$43 77.51,12.97 77.35,12.81 77.35,5.45 v77.11,5.21 | v11.01,20.61 11.01,20.91 10.71,21.21 8.81,21.21 7.91,22.11 7.91,23.11 9.61,24.81 19.47,24.81 v19.41,24.8 | JP1.6 7.29,6.28 v10.11,9.1 | v41.21,21.41 40.3,21.41 31.14,12.25 20.77,12.25 19.51,13.51 U$4.P$43 19.46,14.83 19.46,15.37 19.49,15.4 v19.51,17.33 | v76.91,22.01 76.91,59.61 77.5,60.2 U$2.P$43
  Bottom 0.152: v40.41,26.01 40.41,22.21 v41.21,21.41 43.81,21.41 60.01,5.21 v77.11,5.21 | v76.91,22.01 76.91,17.41 v77.51,16.81 | v11.01,20.61 10.11,19.71 10.11,19.37 10.67,18.8 10.67,9.66 v10.11,9.1 | v19.41,24.8 19.51,24.8 v19.51,17.33
GPIO12  (via drill 0.3)
  Top 0.152: U$1.P$44 20.11,54.71 41.21,33.61 v41.21,22.41 | v41.21,22.41 41.01,22.41 | U$3.P$44 v78.11,6.21 | U$2.P$44 v78.11,22.01 | v10.51,23.91 21.8,23.91 v21.83,23.93 | v20.11,16.61 U$4.P$44 20.11,13.46 20.88,12.69 30.93,12.69 40.65,22.41 v41.21,22.41 | v8.33,10.07 8.31,10.07 JP1.4
  Bottom 0.152: v41.21,22.41 43.81,22.41 60.01,6.21 v78.11,6.21 v78.11,22.01 | v10.51,23.91 9.81,23.21 9.81,21.51 8.51,20.21 8.51,10.25 v8.33,10.07 | v21.83,23.93 21.83,16.77 21.65,16.59 20.12,16.59 v20.11,16.61
MISO  (via drill 0.3)
  Top 0.152: U$1.P$32 12.91,52.51 2.01,42.81 v2.01,26.01 | U$4.P$32 | v60.01,26.01 60.01,41.61 70.91,52.51 U$2.P$32 70.91,64.11 70.75,64.27 65.39,64.27 v64.88,63.76 | v12.91,16.57 U$4.P$32 | v31.31,8.91 31.68,9.28 40.21,9.28 40.59,8.91 40.91,8.91 42.81,10.81 43.11,10.81 v43.31,11.01 43.31,11.31 53.41,21.41 v58.71,21.41 61.81,18.31 63.64,18.31 69.51,12.43 70.58,12.43 70.91,12.76 U$3.P$32 | U$4.P$32 12.91,13.49 12.31,12.89 12.01,12.89 2.49,22.41 v0.71,22.41 | v13.39,7.75 14.15,7.75 v15.96,9.56 | v47.35,57.44 v47.35,65.87 | v47.48,69.7 47.48,78.72 JP4.1
  Bottom 0.152: v2.01,26.01 2.01,23.71 v0.71,22.41 | v60.01,26.01 60.01,22.71 v58.71,21.41 | v31.31,8.91 31.31,9.41 30.11,10.6 29.07,9.56 v15.96,9.56 12.91,12.61 v12.91,16.57 | JP1.9 12.14,4.29 13.39,5.54 v13.39,7.75 | JP3.1 44.18,3.74 43.71,4.21 43.71,10.61 v43.31,11.01 | v64.88,63.76 64.85,63.74 64.85,57.84 64.45,57.44 v47.35,57.44 | v47.35,65.87 47.47,65.98 47.47,69.69 v47.48,69.7
MOSI  (via drill 0.3)
  Top 0.152: U$1.P$31 12.31,53.31 1.21,43.51 1.21,24.11 1.81,23.5 2.55,23.5 11.44,14.61 12.13,14.61 U$4.P$31 | U$4.P$31 | U$3.P$31 68.43,14.78 59.21,24.11 | 59.21,24.11 59.21,42.21 70.31,53.31 U$2.P$31 70.17,62.92 v68.61,62.92 | v12.31,17.35 U$4.P$31 | 59.21,24.11 55.41,24.11 45.66,14.36 | 45.66,14.36 40.71,9.41 40.4,9.71 30.99,9.71 30.69,9.41 v30.31,9.41 | v44.51,14.31 44.56,14.36 45.66,14.36 | JP4.4 51.26,80.02 51.26,78.14 54.06,75.34 v59.49,75.34 | v63.23,73.46 67.02,69.67 67.02,67.76 v66.1,66.83
  Bottom 0.152: v12.31,17.35 12.31,12.38 14.46,10.23 14.46,8.29 15.34,7.41 21.11,7.41 | JP1.7 9.6,1.92 10.61,0.91 20.01,0.91 21.11,2.01 21.11,7.41 | 21.11,7.41 22.41,8.71 29.61,8.71 v30.31,9.41 | JP3.4 50.01,8.81 v44.51,14.31 | v59.49,75.34 61.37,73.46 v63.23,73.46 | v68.61,62.92 66.1,65.44 v66.1,66.83
N$1  (via drill 2 pad 5)
  other vias: 3.01,13.01
N$2  (via drill 2 pad 5)
  other vias: 97.01,49.01
N$3  (via drill 2 pad 5)
  other vias: 39.01,13.01
N$4  (via drill 2 pad 5)
  other vias: 3.01,49.01
N$5  (via drill 2 pad 5)
  other vias: 3.01,61.01
N$6  (via drill 2 pad 5)
  other vias: 3.01,97.01
N$7  (via drill 2 pad 5)
  other vias: 39.01,97.01
N$8  (via drill 2 pad 5)
  other vias: 39.01,61.01
N$9  (via drill 2 pad 5)
  other vias: 61.01,49.01
N$10  (via drill 2 pad 5)
  other vias: 97.01,97.01
N$11  (via drill 2 pad 5)
  other vias: 61.01,97.01
N$12  (via drill 2 pad 5)
  other vias: 97.01,61.01
N$13  (via drill 2 pad 5)
  other vias: 61.01,61.01
N$14  (via drill 2 pad 5)
  other vias: 61.01,13.01
N$15  (via drill 2 pad 5)
  other vias: 97.01,13.01
SCK  (via drill 0.3)
  Top 0.152: U$1.P$33 13.51,51.81 2.81,42.11 v2.81,25.01 v2.8,25.01 | U$4.P$33 13.49,14.77 | v60.81,25.01 60.81,41.11 71.51,51.81 U$2.P$33 71.51,64.27 71.13,64.65 64.24,64.65 v63.2,63.61 | v13.51,17.35 13.49,17.19 13.49,14.77 | v32.31,8.41 32.69,8.79 39.99,8.79 40.37,8.41 42.51,8.41 v44.76,10.66 54.51,20.41 v58.71,20.41 61.21,17.91 63.43,17.91 69.28,12.06 71.38,12.06 71.51,12.18 U$3.P$33 | 13.49,14.77 13.49,13.39 12.48,12.38 11.66,12.38 2.63,21.41 v0.71,21.41 | v17.3,10.37 17.35,10.32 17.35,9.28 15.96,7.88 v15.96,5.14 | v53.32,62.9 50.96,65.26 v50.96,65.79 | v50.96,69.83 50.01,70.78 JP4.3
  Bottom 0.152: v0.71,21.41 2.8,23.5 v2.8,25.01 | v60.81,25.01 60.81,22.51 v58.71,20.41 | v13.51,17.35 13.51,12.9 16.04,10.37 v17.3,10.37 28.66,10.37 29.27,10.98 30.28,10.98 32.31,8.95 v32.31,8.41 | JP1.11 14.68,3.86 v15.96,5.14 | JP3.3 49.88,3.74 48.71,4.91 45.41,4.91 44.71,5.61 44.71,10.61 v44.76,10.66 | v53.32,62.9 54.57,62.9 55.78,64.12 62.52,64.12 63.02,63.61 v63.2,63.61 | v50.96,65.79 v50.96,69.83
SCL  (via drill 0.3)
  Top 0.152: U$1.P$29 v12.91,70.01 12.91,87.41 v18.51,93.01 | U$4.P$29 v12.91,22.01 v11.01,22.01 | U$2.P$29 v70.91,70.01 70.91,82.37 70.09,83.19 70.09,84.28 70.9,85.1 v70.9,93 v70.91,93.01 | v70.91,22.01 U$3.P$29 | JP1.3 5.81,5.03 5.81,6.91 6.4,7.5 6.71,7.5 8.66,9.45 v9.16,9.45
  Bottom 0.152: v12.91,70.01 v12.91,22.01 | v70.91,93.01 v18.51,93.01 | v11.01,22.01 11.01,21.91 9.02,19.92 9.02,17.99 9.41,17.61 9.41,9.7 v9.16,9.45 | v70.91,22.01 70.91,30.11 70.41,30.61 70.41,32.11 70.91,32.61 v70.91,70.01
SDA  (via drill 0.3)
  Top 0.152: U$1.P$30 v12.31,69.21 12.31,87.81 v18.51,94.01 | v12.31,21.21 U$4.P$30 11.72,19.82 v7.08,19.87 | U$2.P$30 70.31,68.71 | 70.31,68.71 v70.31,69.21 | v70.31,21.21 U$3.P$30 | v70.31,94.01 70.31,85.55 69.45,84.69 69.45,82.86 70.26,82.05 70.26,68.76 70.31,68.71
  Bottom 0.152: v12.31,69.21 v12.31,21.21 | v18.51,94.01 v70.31,94.01 | v7.08,19.87 7.11,8.21 5.81,6.91 5.81,4.31 6.41,3.71 7.03,3.71 JP1.5 | v70.31,21.21 70.31,29.71 69.81,30.21 69.81,32.51 70.31,33.01 v70.31,69.21

### Text on the board
tPlace: 6/GND | 1/MOSI | PQ60 FlatSat | Reset | +3V3 | BATV | 6 GND | - | 1/MOSI
tStop: kartikye.com